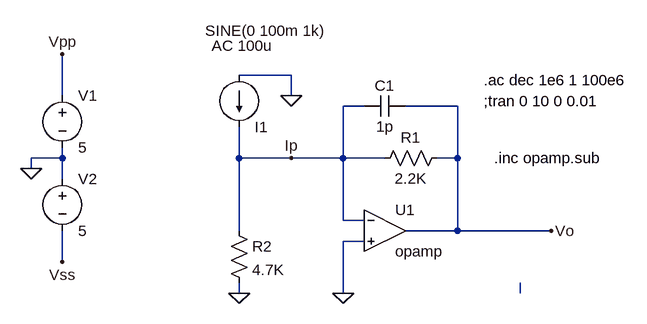
[diagram p0: schematic OpAmpTransimpedance.asc]
OpAmpTransimpedance.asc, the LTspice schematic file:
Version 4
SHEET 1 888 680
WIRE 256 16 176 16
WIRE -96 48 -96 -16
WIRE 256 48 256 16
WIRE 368 64 336 64
WIRE 512 64 432 64
WIRE -96 144 -96 128
WIRE -96 144 -144 144
WIRE 176 144 176 96
WIRE 256 144 176 144
WIRE 336 144 336 64
WIRE 336 144 256 144
WIRE 400 144 336 144
WIRE 512 144 512 64
WIRE 512 144 480 144
WIRE -144 160 -144 144
WIRE -96 176 -96 144
WIRE 336 240 336 144
WIRE 368 240 336 240
WIRE 176 256 176 144
WIRE 512 256 512 144
WIRE 512 256 432 256
WIRE 656 256 512 256
WIRE 368 272 336 272
WIRE -96 304 -96 256
WIRE 176 352 176 336
WIRE 336 352 336 272
WIRE 608 352 608 336
FLAG -144 160 0
FLAG -96 -16 Vpp
FLAG -96 304 Vss
FLAG 336 352 0
FLAG 176 352 0
FLAG 656 256 Vo
FLAG 256 48 0
FLAG 256 144 Ip
SYMBOL res 496 128 R90
WINDOW 0 0 56 VBottom 2
WINDOW 3 32 56 VTop 2
SYMATTR InstName R1
SYMATTR Value 2.2K
SYMBOL cap 432 48 R90
WINDOW 0 0 32 VBottom 2
WINDOW 3 32 32 VTop 2
SYMATTR InstName C1
SYMATTR Value 1p
SYMBOL voltage -96 32 R0
WINDOW 123 0 0 Left 0
WINDOW 39 0 0 Left 0
SYMATTR InstName V1
SYMATTR Value 5
SYMBOL voltage -96 160 R0
WINDOW 123 0 0 Left 0
WINDOW 39 0 0 Left 0
SYMATTR InstName V2
SYMATTR Value 5
SYMBOL res 160 240 R0
SYMATTR InstName R2
SYMATTR Value 4.7K
SYMBOL current 176 16 R0
WINDOW 0 24 80 Left 2
WINDOW 3 -52 -68 Left 2
WINDOW 123 -42 -45 Left 2
WINDOW 39 0 0 Left 0
SYMATTR InstName I1
SYMATTR Value SINE(0 100m 1k)
SYMATTR Value2 AC 100u
SYMBOL OpAmps\\opamp 400 192 R0
SYMATTR InstName U1
TEXT 552 24 Left 2 !.ac dec 1e6 1 100e6
TEXT 552 56 Left 2 !;tran 0 10 0 0.01
TEXT 568 144 Left 2 !.inc opamp.sub

The netlist it stands for:
* OpAmpTransimpedance.asc
R1 Vo Ip 2.2K
C1 Vo Ip 1p
V1 Vpp 0 5
V2 0 Vss 5
R2 Ip 0 4.7K
I1 0 Ip SINE(0 100m 1k) AC 100u
XU1 Ip 0 Vo opamp Aol=100K GBW=10Meg  ; pins invin noninvin out
.ac dec 1e6 1 100e6
;tran 0 10 0 0.01
.inc opamp.sub
.backanno
.end